# EasyEDA Pro project Transistor-theremin_2026-03-18_10-14-34.eprj

# Schematic transistor-theremin
Board Name: transistor-theremin; Create Date: 2026-03-18; Page Name: transistor-theremin; Project Name: Transistor-theremin_2026-03-18_10-14-34; Schematic Name: transistor-theremin; Update Date: 2026-03-24; File: transistor-theremin; Id: /; Sheet: /
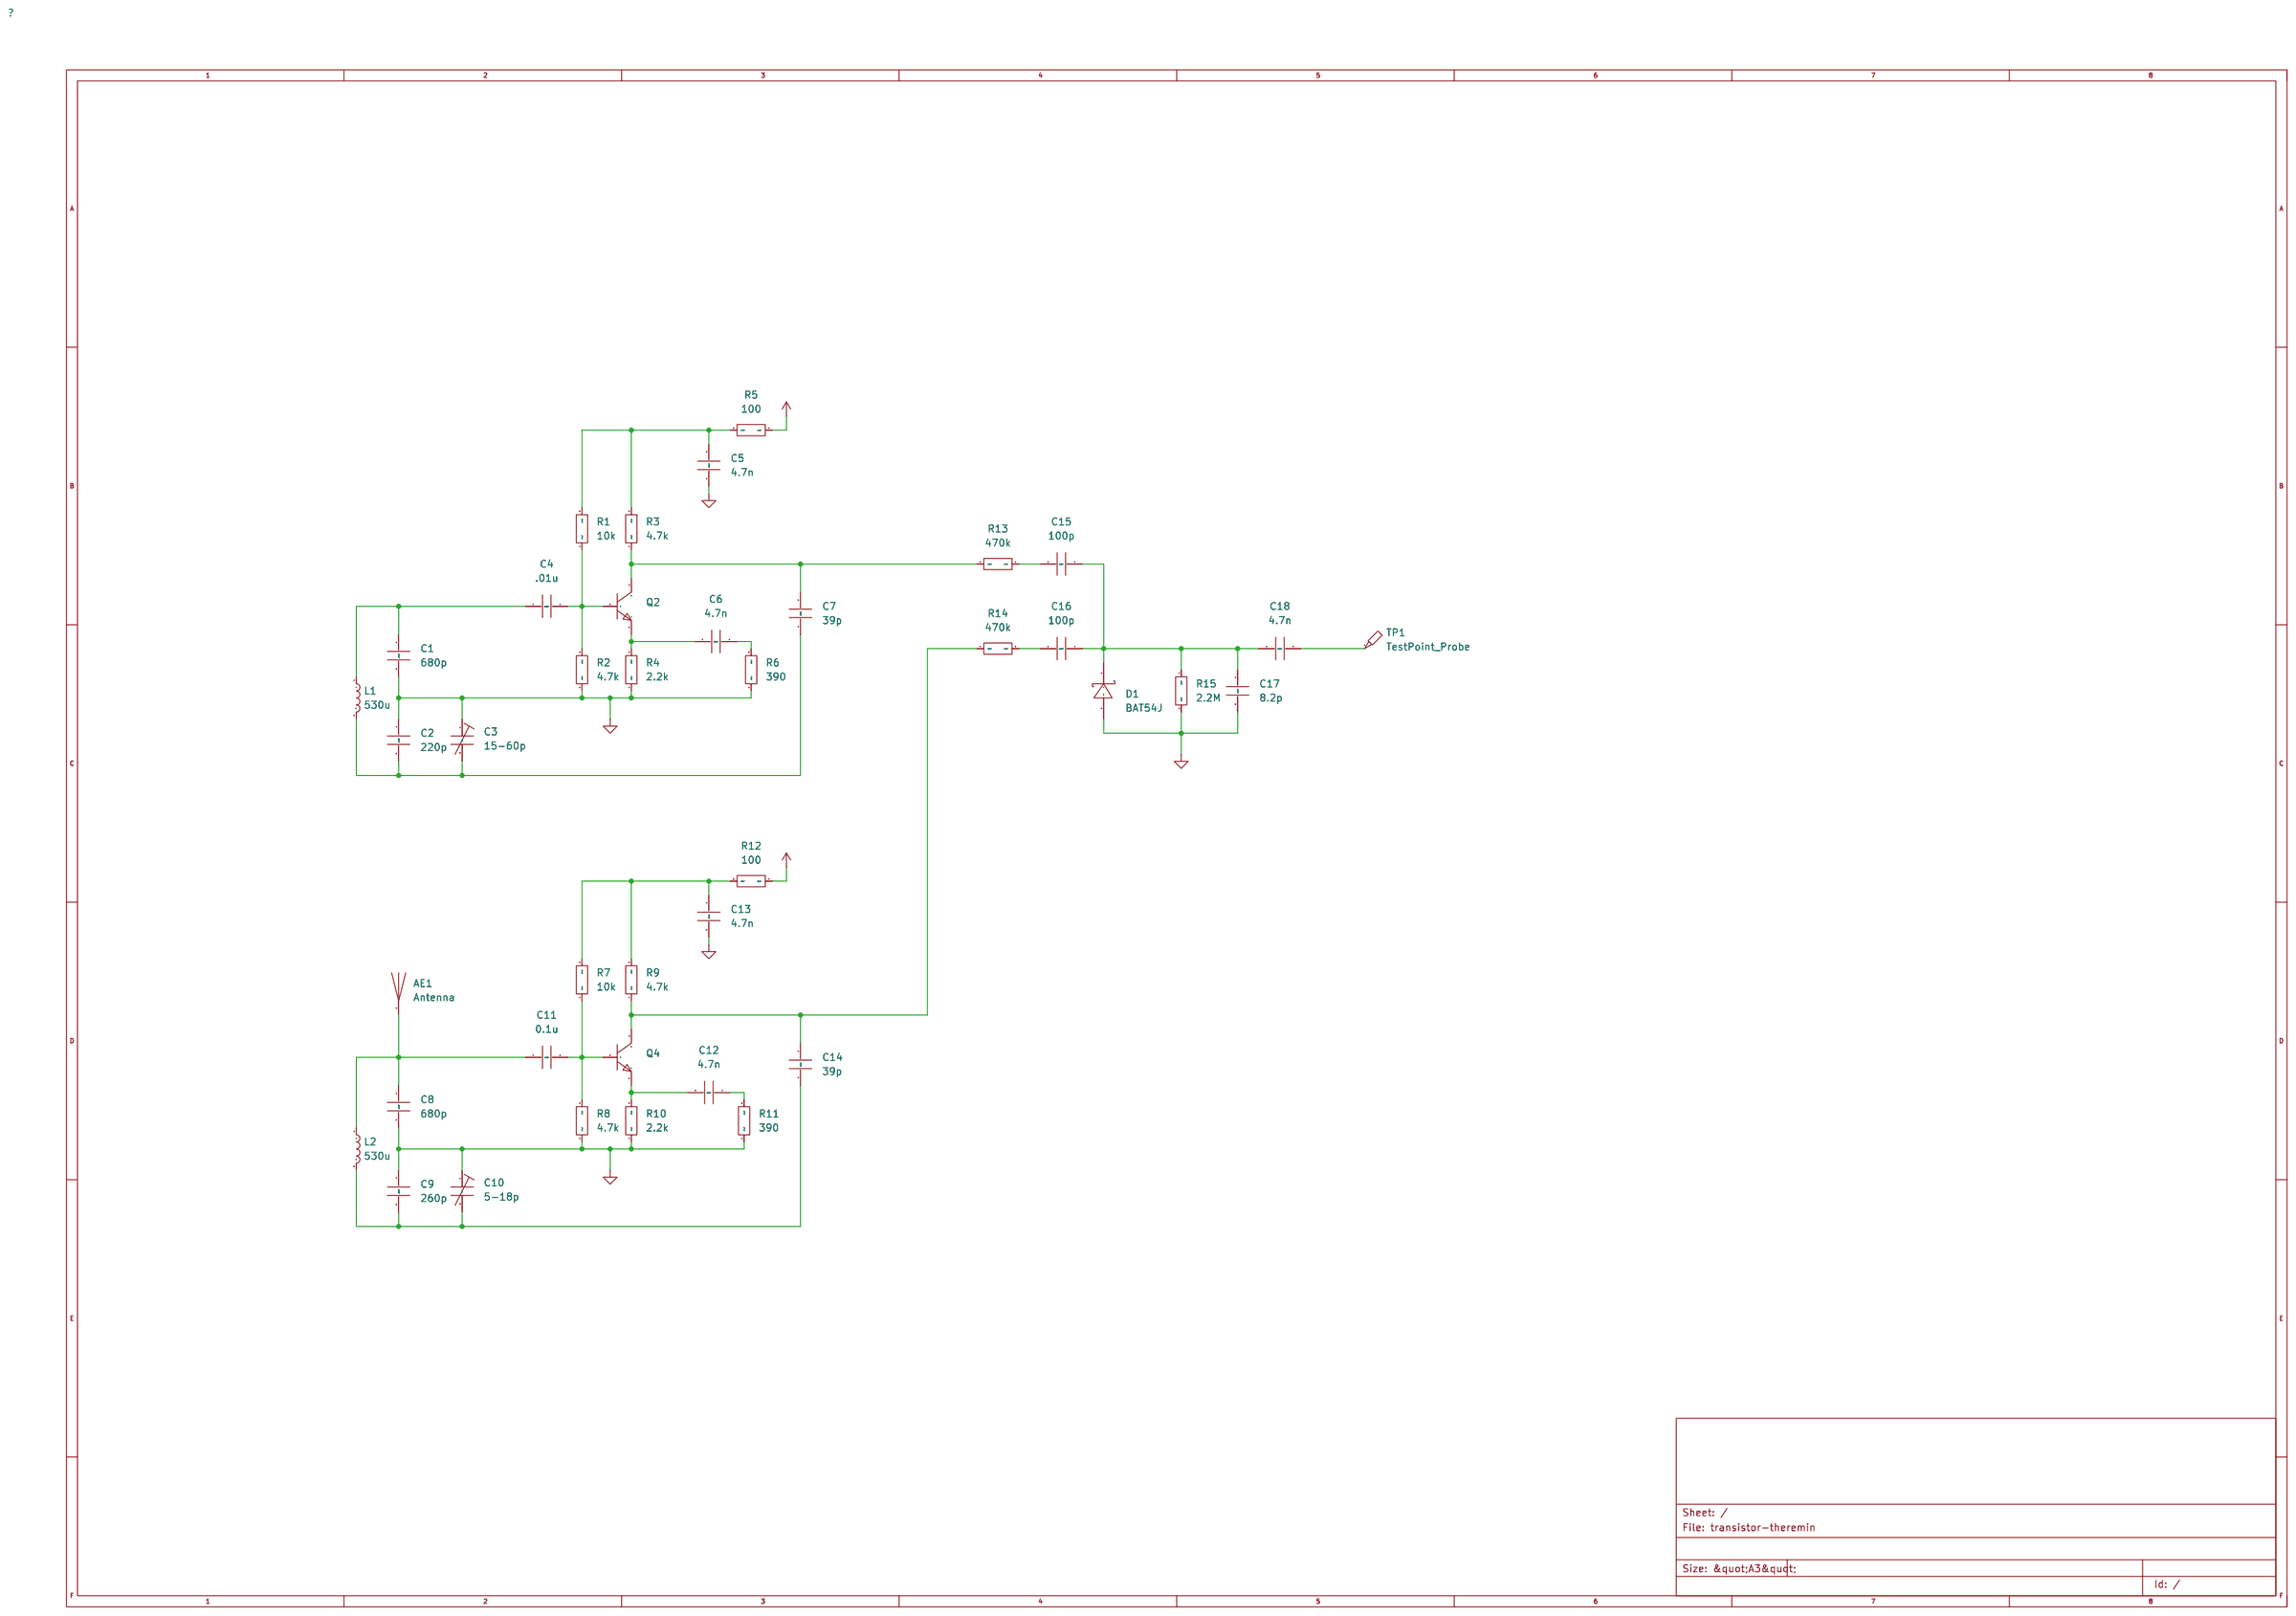
[diagram p0: schematic sheet]

## Parts
AE1  Antenna
C1  680p
C2  220p
C3  15-60p
C4  .01u
C5  4.7n
C6  4.7n
C7  39p
C8  680p
C9  260p
C10  5-18p
C11  0.1u
C12  4.7n
C13  4.7n
C14  39p
C15  100p
C16  100p
C17  8.2p
C18  4.7n
D1  BAT54J  [SOD-323_L1.8-W1.3-LS2.5-RD]
L1  530u
L2  530u
Q2  -  [SOT-23-3_L2.9-W1.3-P1.90-LS2.4-BR]
Q4  -  [SOT-23-3_L2.9-W1.3-P1.90-LS2.4-BR]
R1  10k
R2  4.7k
R3  4.7k
R4  2.2k
R5  100
R6  390
R7  10k
R8  4.7k
R9  4.7k
R10  2.2k
R11  390
R12  100
R13  470k
R14  470k
R15  2.2M
TP1  TestPoint_Probe

## Library data of the parts
AE1 = Device_Antenna
C1 C2 C4-C9 C11-C18 = Device_C: Unpolarized capacitor
C3 C10 = Device_C_Trim: Trimmable capacitor
D1 = BAT54J: LCSC Part Name: 电压:30V 电流:200mA; Supplier Part: C358488; Manufacturer: BLUE ROCKET(蓝箭); Supplier Footprint: SOD-323; JLCPCB Part Class: Extended Part; Datasheet: https://atta.szlcsc.com/upload/public/pdf/source/20190124/C358488_9C6DF770F975F6DD201437EC9D504B6F.pdf; Supplier: LCSC; Diode Configuration: Independent Type; Forward Voltage (Vf@If): 800mV@100mA; Reverse Voltage (Vr): 30V; Rectified Current: 200mA; Reverse Leakage Current (Ir): 2uA@25V
L1 L2 = Device_L: Inductor
Q2 Q4 = MMBT3904: LCSC Part Name: MMBT3904 1AM 100-300 1AM  100-300; Supplier Part: C20526; Manufacturer: CJ(江苏长电/长晶); Supplier Footprint: SOT-23(SOT-23-3); JLCPCB Part Class: Basic Part; Datasheet: https://atta.szlcsc.com/upload/public/pdf/source/20140809/1457707206600.pdf; Supplier: LCSC; Collector-Emitter Saturation Voltage (VCE(sat)@Ic,Ib): 300mV@50mA,5mA; DC Current Gain (hFE@Ic,Vce): 100@10mA,1V; Transition Frequency (fT): 300MHz; Operating Temperature: +150℃@(Tj)
R1-R15 = Device_R: Resistor
TP1 = Connector_TestPoint_Probe: test point (alternative probe-style design)

## Nets
POWER_+12V: R5.1 R12.1
POWER_GND: C1.2 C2.1 C3.1 C5.1 C8.2 C9.1 C10.1 C13.1 C17.2 D1.2 R2.2 R4.1 R6.1 R8.2 R10.1 R11.1 R15.2
Net-(AE1-1): AE1.1(A) C8.1 C11.1 L2.1
Net-(C1-1): C1.1 C4.1 L1.1
Net-(C2-2): C2.2 C3.2 C7.1 L1.2
Net-(C4-2): C4.2 Q2.1(B) R1.1 R2.1
Net-(C5-2): C5.2 R1.2 R3.2 R5.2
Net-(C6-1): C6.1 R6.2
Net-(C6-2): C6.2 Q2.2(E) R4.2
Net-(C7-2): C7.2 Q2.3(C) R3.1 R13.2
Net-(C9-2): C9.2 C10.2 C14.1 L2.2
Net-(C11-2): C11.2 Q4.1(B) R7.1 R8.1
Net-(C12-1): C12.1 R11.2
Net-(C12-2): C12.2 Q4.2(E) R10.2
Net-(C13-2): C13.2 R7.2 R9.2 R12.2
Net-(C14-2): C14.2 Q4.3(C) R9.1 R14.2
Net-(C15-1): C15.1 C16.1 C17.1 C18.1 D1.1 R15.1
Net-(C15-2): C15.2 R13.1
Net-(C16-2): C16.2 R14.1
Net-(C18-2): C18.2 TP1.1
